# EAGLE design AtMega88 (EAGLE 6.5.0)
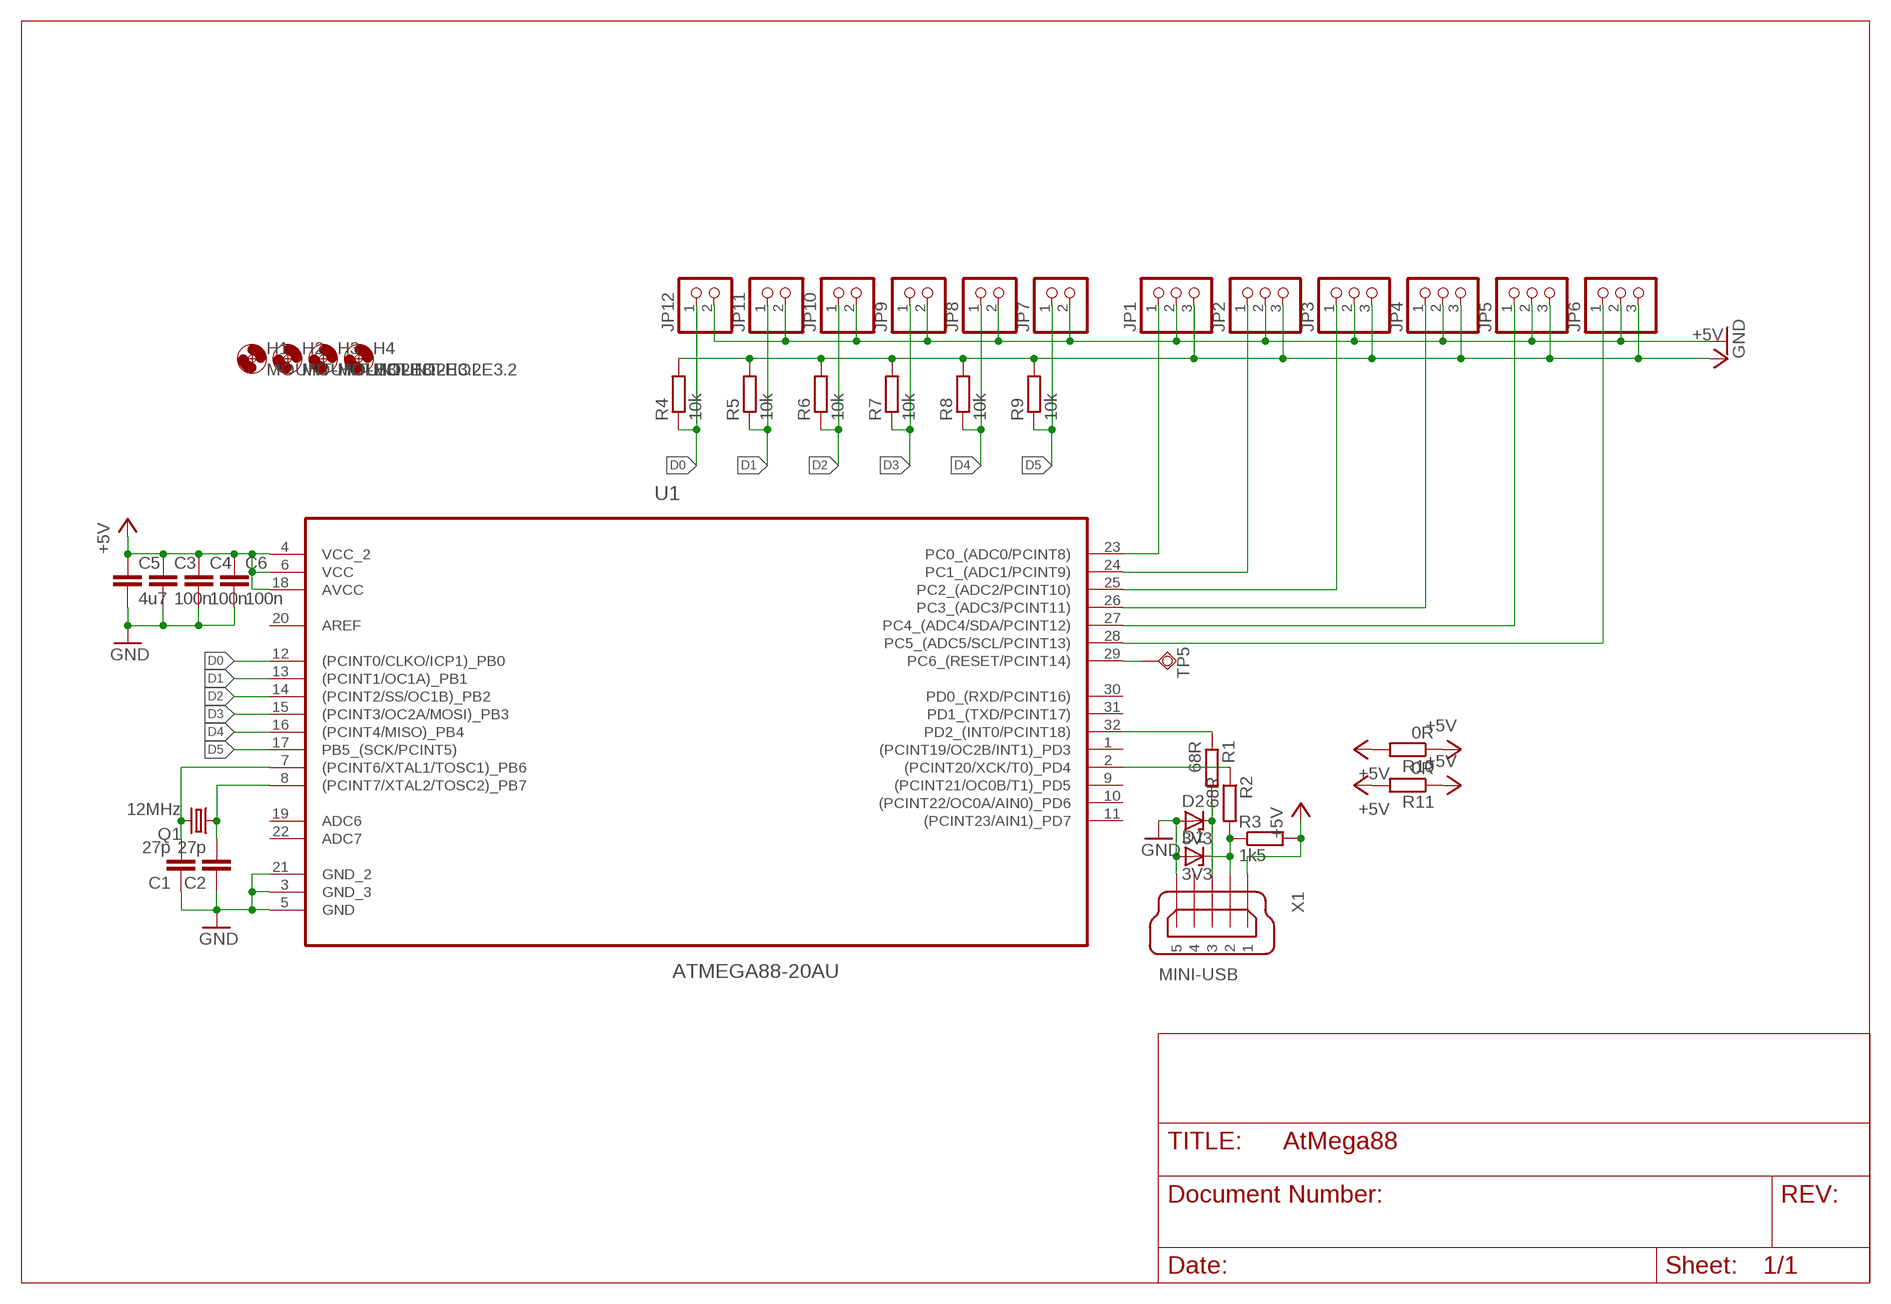
[diagram p0: schematic, sheet 1]

## Parts
C1  27p  C-EUC0805  [C0805]
C2  27p  C-EUC0805  [C0805]
C3  100n  C-EUC0805  [C0805]
C4  100n  C-EUC0805  [C0805]
C5  4u7  C-EUC0805  [C0805]
C6  100n  C-EUC0805  [C0805]
D1  3V3  ZENER-DIODESOT23  [SOT23]
D2  3V3  ZENER-DIODESOT23  [SOT23]
H1  MOUNT-HOLE3.2  [3,2]
H2  MOUNT-HOLE3.2  [3,2]
H3  MOUNT-HOLE3.2  [3,2]
H4  MOUNT-HOLE3.2  [3,2]
JP1  PINHD-1X3  [1X03]
JP2  PINHD-1X3  [1X03]
JP3  PINHD-1X3  [1X03]
JP4  PINHD-1X3  [1X03]
JP5  PINHD-1X3  [1X03]
JP6  PINHD-1X3  [1X03]
JP7  PINHD-1X2  [1X02]
JP8  PINHD-1X2  [1X02]
JP9  PINHD-1X2  [1X02]
JP10  PINHD-1X2  [1X02]
JP11  PINHD-1X2  [1X02]
JP12  PINHD-1X2  [1X02]
Q1  12MHz  CSM-7X-DU  [CSM-7X-DU]
R1  68R  R-EU_R1206  [R1206]
R2  68R  R-EU_R1206  [R1206]
R3  1k5  R-EU_R1206  [R1206]
R4  10k  R-EU_R1206  [R1206]
R5  10k  R-EU_R1206  [R1206]
R6  10k  R-EU_R1206  [R1206]
R7  10k  R-EU_R1206  [R1206]
R8  10k  R-EU_R1206  [R1206]
R9  10k  R-EU_R1206  [R1206]
R10  0R  R-EU_R1206  [R1206]
R11  0R  R-EU_R1206  [R1206]
TP5  TPSQTP20SQ  [TP20SQ]
U1  ATMEGA88-20AU  [QFP80P900X900X120-32N]
X1  MINI-USB  MINI-USB-UX60A-MB-5ST  [UX60A-MB-5ST]

## Nets
+5V: C3.1 C4.1 C5.1 C6.1 JP1.3 JP2.3 JP3.3 JP4.3 JP5.3 JP6.3 R3.2 R4.2 R5.2 R6.2 R7.2 R8.2 R9.2 R10.1 R10.2 R11.1 R11.2 U1.4(VCC_2) U1.6(VCC) U1.18(AVCC) X1.1
A0: JP1.1 U1.23(PC0_(ADC0/PCINT8))
A1: JP2.1 U1.24(PC1_(ADC1/PCINT9))
A2: JP3.1 U1.25(PC2_(ADC2/PCINT10))
A3: JP4.1 U1.26(PC3_(ADC3/PCINT11))
A4: JP5.1 U1.27(PC4_(ADC4/SDA/PCINT12))
A5: JP6.1 U1.28(PC5_(ADC5/SCL/PCINT13))
D0: JP12.1 R4.1 U1.12((PCINT0/CLKO/ICP1)_PB0)
D1: JP11.1 R5.1 U1.13((PCINT1/OC1A)_PB1)
D2: JP10.1 R6.1 U1.14((PCINT2/SS/OC1B)_PB2)
D3: JP9.1 R7.1 U1.15((PCINT3/OC2A/MOSI)_PB3)
D4: JP8.1 R8.1 U1.16((PCINT4/MISO)_PB4)
D5: JP7.1 R9.1 U1.17(PB5_(SCK/PCINT5))
GND: C1.1 C2.1 C3.2 C4.2 C5.2 C6.2 D1.1(A) D2.1(A) JP1.2 JP2.2 JP3.2 JP4.2 JP5.2 JP6.2 JP7.2 JP8.2 JP9.2 JP10.2 JP11.2 JP12.2 U1.3(GND_3) U1.5(GND) U1.21(GND_2) X1.5
N$4: C1.2 Q1.2 U1.7((PCINT6/XTAL1/TOSC1)_PB6)
N$5: C2.2 Q1.1 U1.8((PCINT7/XTAL2/TOSC2)_PB7)
N$6: R1.1 U1.32(PD2_(INT0/PCINT18))
N$7: R2.1 U1.2((PCINT20/XCK/T0)_PD4)
N$10: D2.3(C) R1.2 X1.3
N$11: D1.3(C) R2.2 R3.1 X1.2
N$14: TP5.TP U1.29(PC6_(RESET/PCINT14))
Unconnected: U1.1((PCINT19/OC2B/INT1)_PD3) U1.9((PCINT21/OC0B/T1)_PD5) U1.10((PCINT22/OC0A/AIN0)_PD6) U1.11((PCINT23/AIN1)_PD7) U1.19(ADC6) U1.20(AREF) U1.22(ADC7) U1.30(PD0_(RXD/PCINT16)) U1.31(PD1_(TXD/PCINT17)) X1.4

## Library data of the parts
C1-C6 = rcl:C-EU: CAPACITOR, European symbol
D1 D2 = diode:ZENER-DIODE: Z-Diode
H1-H4 = holes:MOUNT-HOLE: MOUNTING HOLE with drill center marker
JP1-JP6 = pinhead:PINHD-1X3: PIN HEADER
JP7-JP12 = pinhead:PINHD-1X2: PIN HEADER
Q1 = crystal:CSM-7X-DU: SMD CRYSTAL Source: www.ecsxtal.com .. Crystal 3.6864MHz CSM_7X_DU.PDF; OC_FARNELL: unknown; OC_NEWARK: unknown
R1-R11 = rcl:R-EU_: RESISTOR, European symbol
TP5 = testpad:TPSQ: Test pad
U1 = atmel:ATMEGA88-20AU: Microcontroller; DESCRIPTION: Microcontroller; MPN: ATMEGA88-20AU; OC_FARNELL: 9171487; OC_NEWARK: 01M6912; PACKAGE: QFP-32; SUPPLIER: ATMEL
X1 = con-hirose:MINI-USB-: MINI USB Connector Source: http://www.hirose.co.jp/cataloge_hp/e24000019.pdf; OC_FARNELL: unknown; OC_NEWARK: unknown

## Board
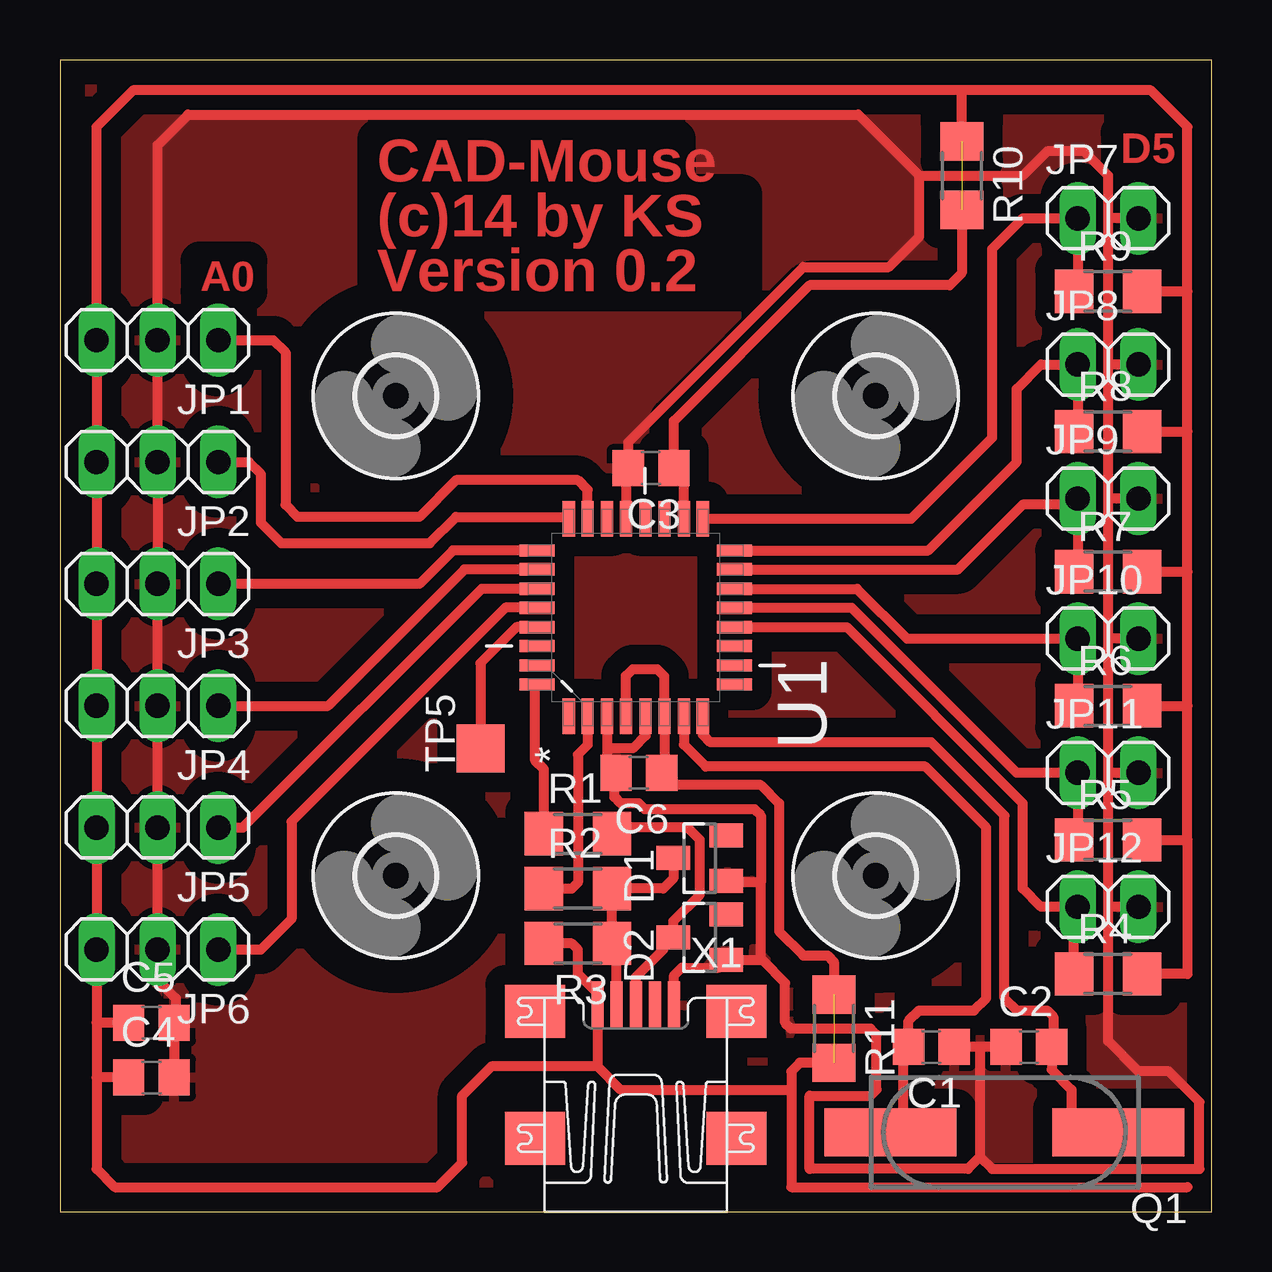
[diagram p1: board, top side]

Size 48 x 48 mm. Coordinates in mm from the lower left corner, seen from the top.
Outline: 0,0 48,0 48,48 0,48 0,0
Copper layers (1*16): Top 0.035mm / dielectric 1.5mm / Bottom 0.035mm
Design rules "default": minimum track width 10mil, minimum drill 24mil, track to track 8mil, track to pad 8mil, pad to pad 8mil, via to via 8mil, smd to smd 8mil, copper to edge 40mil, drill to drill 8mil, minimum pad ring 10mil, minimum via ring 8mil, stop-mask expansion 4mil, vias tented up to drill 0mil, thermal gap 10mil

### Footprints (pad centres in the part's own frame; a part is rotated, then mirrored left to right if it is on the bottom)
C0805 = smd 1.3 x 1.5: 1 -0.95,0; 2 0.95,0
SOT23 = smd 1 x 1.4: 1 -0.95,-1.1; 2 0.95,-1.1; 3 0,1.1
3,2 = hole 3.2: 0,0
1X03 = drill 1.016 long: 1 -2.54,0; 2 0,0; 3 2.54,0
1X02 = drill 1.016 long: 1 -1.27,0; 2 1.27,0
CSM-7X-DU = smd 5.5 x 2: 1 -4.75,0; 2 4.75,0
R1206 = smd 1.6 x 1.803: 1 -1.422,0; 2 1.422,0
TP20SQ = smd 2 x 2: TP 0,0
QFP80P900X900X120-32N = smd 1.473 x 0.508: 1 -4.115,2.794; 2 -4.115,2.007; 3 -4.115,1.194; 4 -4.115,0.406; 5 -4.115,-0.406; 6 -4.115,-1.194; 7 -4.115,-2.007; 8 -4.115,-2.794; 17 4.115,-2.794; 18 4.115,-2.007; 19 4.115,-1.194; 20 4.115,-0.406; 21 4.115,0.406; 22 4.115,1.194; 23 4.115,2.007; 24 4.115,2.794 | smd 0.508 x 1.473: 9 -2.794,-4.115; 10 -2.007,-4.115; 11 -1.194,-4.115; 12 -0.406,-4.115; 13 0.406,-4.115; 14 1.194,-4.115; 15 2.007,-4.115; 16 2.794,-4.115; 25 2.794,4.115; 26 2.007,4.115; 27 1.194,4.115; 28 0.406,4.115; 29 -0.406,4.115; 30 -1.194,4.115; 31 -2.007,4.115; 32 -2.794,4.115
UX60A-MB-5ST = smd 2 x 0.5: 1 2.25,1.6; 2 2.25,0.8; 3 2.25,0; 4 2.25,-0.8; 5 2.25,-1.6 | smd 2.2 x 2.5: M1 -3.3,-4.2; M2 -3.3,4.2; M3 2,4.2; M4 2,-4.2

### Placement (x,y rotation side)
C1  36.32,6.86 180 top
C2  40.39,6.86 0 top
C3  24.64,30.99 180 top
C4  3.81,5.59 0 top
C5  3.81,7.87 0 top
C6  24.13,18.29 180 top
D1  [SOT23]  26.67,14.73 90 top
D2  [SOT23]  26.67,11.43 90 top
H1  14,14 0 top
H2  34,34 0 top
H3  14,34 0 top
H4  34,14 0 top
JP1  4.06,36.32 180 top
JP2  4.06,31.24 180 top
JP3  4.06,26.16 180 top
JP4  4.06,21.08 180 top
JP5  4.06,16 180 top
JP6  4.06,10.92 180 top
JP7  43.69,41.4 0 top
JP8  43.69,35.31 0 top
JP9  43.69,29.72 0 top
JP10  43.69,23.88 0 top
JP11  43.69,18.29 0 top
JP12  43.69,12.7 0 top
Q1  39.37,3.3 180 top
R1  [R1206]  21.59,15.75 0 top
R2  [R1206]  21.59,13.46 0 top
R3  [R1206]  21.59,11.18 180 top
R4  [R1206]  43.69,9.91 0 top
R5  [R1206]  43.69,15.49 0 top
R6  [R1206]  43.69,21.08 0 top
R7  [R1206]  43.69,26.67 0 top
R8  [R1206]  43.69,32.51 0 top
R9  [R1206]  43.69,38.35 0 top
R10  [R1206]  37.59,43.18 270 top
R11  [R1206]  32.26,7.62 270 top
TP5  17.53,19.3 90 top
U1  24,24.76 90 top
X1  24,6.35 90 top

### Tracks (layer width: path | path; a pad name or v marks a point on that pad's centre or on a via)
+5V  (2 unrouted)
  Top 0.406: R3.2 21.34,11.18 21.59,10.92 21.59,9.91 22.4,9.1 X1.1 22.4,6.05 | 23.59,21.05 U1.4 23.59,22.32 23.88,22.61 24.89,22.61 25.19,22.3 U1.6 25.19,18.4 C6.1 25.59,17.78 29.21,17.78 29.97,17.02 29.97,11.68 30.99,10.67 32,10.67 32.26,10.41 R11.1 | R5.2 46.99,15.49 | 46.99,15.49 46.99,9.91 R4.2 | 46.99,15.49 46.99,21.08 | 46.99,21.08 46.99,26.67 | 46.99,26.67 46.99,32.51 | 46.99,38.35 R9.2 | R8.2 46.99,32.51 | R7.2 46.99,26.67 | R6.2 46.99,21.08 | 22.4,6.05 23.37,5.08 30.48,5.08 | 30.48,5.08 30.48,1.02 46.99,1.02 | U1.18 26.01,30.57 C3.1 25.59,32.95 31.24,38.61 37.08,38.61 37.59,39.12 R10.2 | 46.99,32.51 46.99,38.35 | 46.99,38.35 46.99,45.21 45.47,46.74 37.59,46.74 | 37.59,46.74 3.05,46.74 1.52,45.21 JP1.3 JP2.3 JP3.3 JP4.3 JP5.3 JP6.3 1.52,7.87 | R10.1 37.59,46.74 | 1.52,7.87 1.52,5.59 | 1.52,5.59 1.52,1.78 2.29,1.02 15.75,1.02 16.76,2.03 16.76,4.83 17.99,6.05 22.4,6.05 | R11.2 30.84,6.2 30.48,5.84 30.48,5.08 | C5.1 1.52,7.87 | C4.1 1.52,5.59
A0
  Top 0.406: JP1.1 8.89,36.32 9.4,35.81 9.4,29.46 9.91,28.96 14.99,28.96 16.51,30.48 21.59,30.48 21.99,30.08 U1.23 21.99,29.32
A1
  Top 0.406: JP2.1 7.87,31.24 8.38,30.73 8.38,28.7 9.22,27.86 15.41,27.86 16.51,28.96 21.13,28.96 U1.24
A2
  Top 0.406: JP3.1 14.99,26.16 16.38,27.56 U1.25
A3
  Top 0.406: JP4.1 11.18,21.08 16.86,26.77 U1.26
A4
  Top 0.406: JP5.1 7.62,16 17.57,25.96 U1.27
A5
  Top 0.406: JP6.1 8.38,10.92 9.65,12.19 9.65,16.26 18.56,25.17 U1.28
D0
  Top 0.406: R4.1 42.27,12.6 JP12.1 40.89,12.7 40.13,13.46 40.13,17.02 32.79,24.36 U1.12
D1
  Top 0.406: R5.1 42.42,15.6 JP11.1 39.88,18.29 33,25.17 U1.13
D2
  Top 0.406: R6.1 42.42,21.23 JP10.1 35.31,23.88 33.23,25.96 U1.14
D3
  Top 0.406: JP9.1 42.42,29.46 | 42.42,29.46 42.42,26.82 R7.1 | 42.42,29.46 40.13,29.46 37.44,26.77 U1.15
D4
  Top 0.406: R8.1 42.42,32.61 JP8.1 40.89,35.31 39.88,34.29 39.88,31.24 36.19,27.56 U1.16
D5
  Top 0.406: R9.1 42.42,38.51 JP7.1 40.13,41.4 38.86,40.13 38.86,32.26 35.48,28.88 U1.17
GND
  Top 0.406: X1.5 25.6,9.85 25.91,10.16 27.45,10.16 D2.1 29.28,10.48 | 29.21,13.72 27.84,13.72 D1.1 | 29.21,13.72 29.21,10.55 29.28,10.48 | 29.21,13.72 29.21,16.51 28.96,16.76 24.38,16.76 24.13,17.02 23.37,17.02 23.11,17.27 23.11,18.22 C6.2 | 22.81,18.41 C6.2 | C2.1 38.35,6.86 | 38.35,6.86 C1.1 | 38.35,6.86 38.35,2.29 | 38.35,2.29 37.85,1.78 31.24,1.78 31.24,4.83 33.78,4.83 34.04,5.08 34.04,7.37 33.78,7.62 30.48,7.62 30.23,7.87 30.23,9.53 29.28,10.48 | JP12.2 43.69,12.7 | 43.69,12.7 43.69,18.29 | 43.69,18.29 43.69,23.88 | 43.69,23.88 43.69,29.72 | 43.69,29.72 43.69,35.31 | 43.69,35.31 43.69,41.4 | 43.69,41.4 43.69,43.18 42.67,44.2 41.15,44.2 40.13,43.18 35.81,43.18 | JP9.2 43.69,29.72 | JP8.2 43.69,35.31 | U1.3 22.81,19.3 | 22.81,19.3 22.81,18.92 C6.2 | U1.5 24.41,19.83 23.88,19.3 22.81,19.3 | U1.21 23.59,30.89 C3.2 23.69,32.07 30.99,39.37 34.54,39.37 35.81,40.64 35.81,43.18 | JP7.2 43.69,41.4 | 35.81,43.18 33.27,45.72 5.33,45.72 4.06,44.45 JP1.2 JP2.2 JP3.2 JP4.2 JP5.2 JP6.2 4.06,9.65 4.83,8.89 4.83,7.94 C5.2 C4.2 | JP11.2 43.69,18.29 | JP10.2 43.69,23.88 | 38.35,2.29 38.86,1.78 47.5,1.78 47.5,4.57 46.23,5.84 44.96,5.84 43.69,7.11 43.69,12.7
  pour Top (isolate 0.813): 0,0 48.01,0 48.01,48.01 0,48.01
N$4
  Top 0.406: Q1.2 35.13,3.81 35.13,6.61 C1.2 35.37,7.94 35.81,8.38 38.1,8.38 38.61,8.89 38.61,16 36.07,18.54 26.92,18.54 26.01,19.46 U1.7
N$5
  Top 0.406: Q1.1 44.37,3.05 42.16,3.05 42.16,5.08 41.34,5.91 C2.2 41.4,6.92 41.4,8.13 41.15,8.38 39.88,8.38 39.37,8.89 39.37,16.51 36.32,19.56 27.12,19.56 26.79,19.89 U1.8
N$6
  Top 0.406: R1.1 20.17,18.44 19.81,18.8 19.81,21.89 U1.32
N$7
  Top 0.406: R2.1 21.34,13.46 21.59,13.72 21.59,19.05 21.99,19.45 U1.2
N$10
  Top 0.406: X1.3 24,9.78 25.15,10.92 25.15,11.01 D2.3 25.57,12.11 26.67,13.21 26.67,15.49 26.16,16 23.27,16 R1.2
N$11
  Top 0.406: X1.2 23.2,10.99 R3.1 R2.2 25.15,13.46 25.57,13.89 D1.3
N$14
  Top 0.406: TP5.TP 17.53,22.86 19.02,24.36 U1.29

### Text on the board
Top: D5 | CAD-Mouse | (c)14 by KS | A0 | Version 0.2